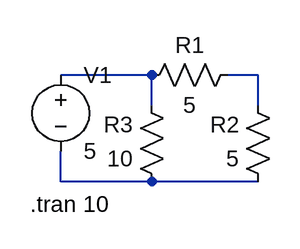
[diagram p0: schematic Filter.asc]
Filter.asc, the LTspice schematic file:
Version 4.1
SHEET 1 880 680
WIRE -512 -576 -608 -576
WIRE -400 -576 -432 -576
WIRE -512 -544 -512 -576
WIRE -400 -544 -400 -576
WIRE -608 -464 -608 -496
WIRE -512 -464 -608 -464
WIRE -400 -464 -512 -464
SYMBOL voltage -608 -592 R0
WINDOW 123 0 0 Left 0
WINDOW 39 0 0 Left 0
SYMATTR InstName V1
SYMATTR Value 5
SYMBOL res -416 -592 R90
WINDOW 0 0 56 VBottom 2
WINDOW 3 32 56 VTop 2
SYMATTR InstName R1
SYMATTR Value 5
SYMBOL res -384 -448 R180
WINDOW 0 36 76 Left 2
WINDOW 3 36 40 Left 2
SYMATTR InstName R2
SYMATTR Value 5
SYMBOL res -496 -448 R180
WINDOW 0 36 76 Left 2
WINDOW 3 36 40 Left 2
SYMATTR InstName R3
SYMATTR Value 10
TEXT -640 -440 Left 2 !.tran 10

The netlist it stands for:
* Filter.asc
V1 N001 N003 5
R1 N002 N001 5
R2 N003 N002 5
R3 N003 N001 10
.tran 10
.backanno
.end